# Altium project ECG circuit_PCB.PrjPcb
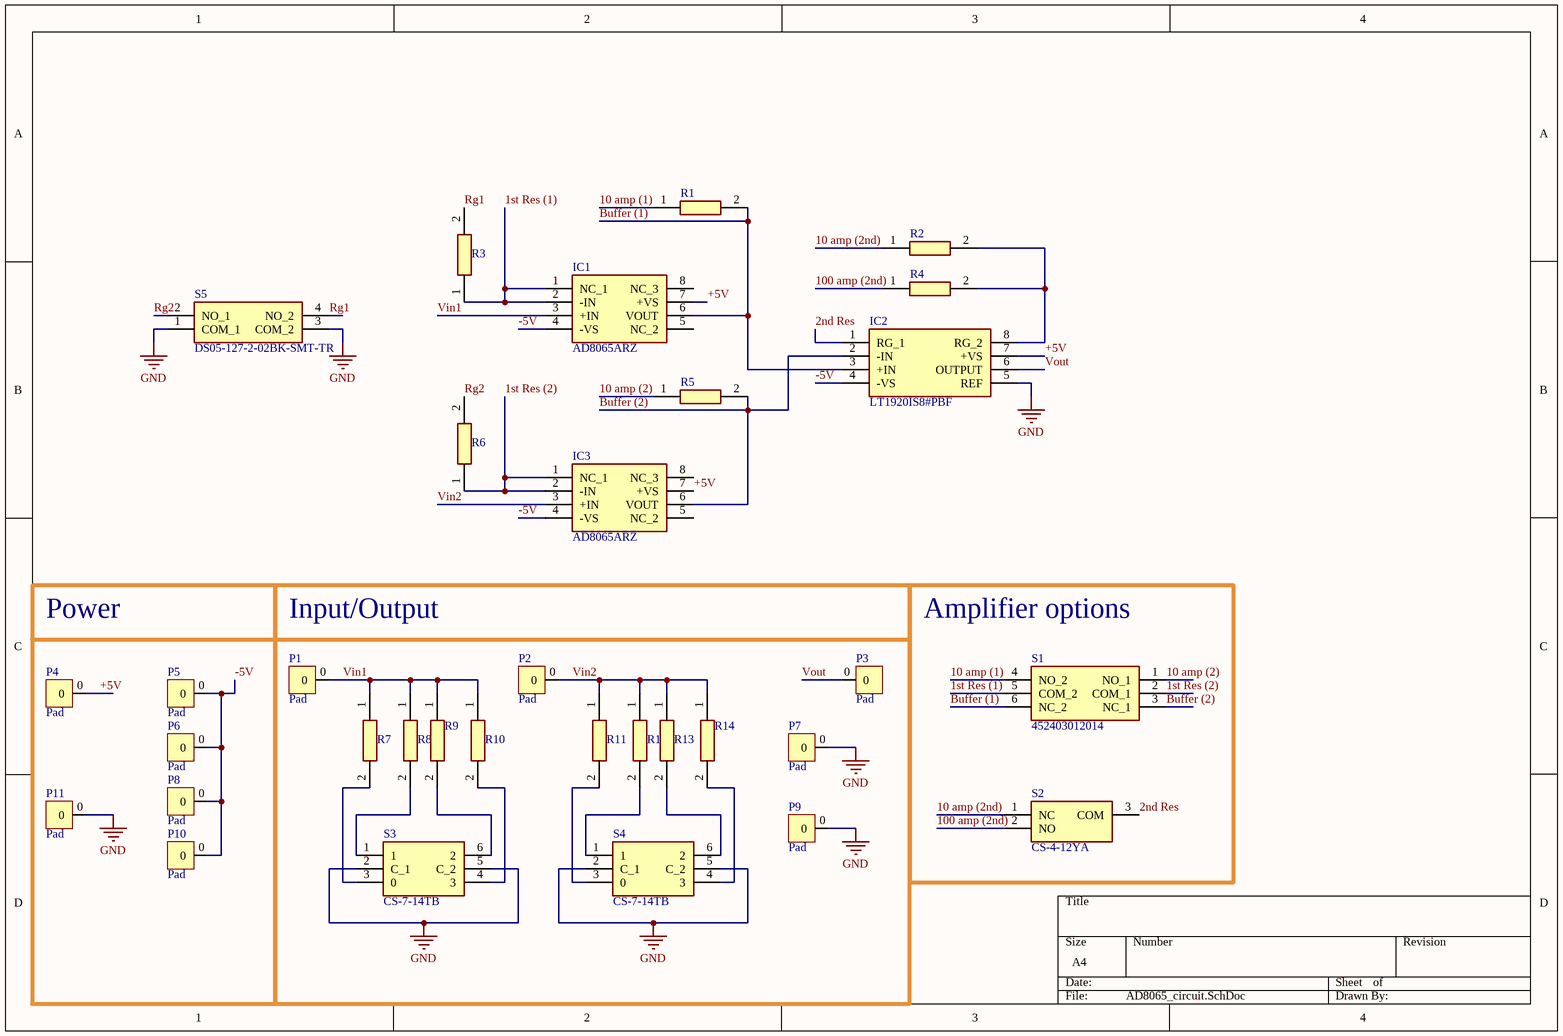
[diagram p0: AD8065_circuit.SchDoc]
1 sheet, 33 parts. Net scope: global (net labels, ports and power ports of the same name join across sheets).
Board file: AD8065_PCB.PcbDoc

## Sheet AD8065_circuit.SchDoc
size A4

### Parts
IC1  AD8065ARZ  [SOIC127P600X175-8N]
IC2  LT1920IS8#PBF  [SOIC127P599X175-8N]
IC3  AD8065ARZ  [SOIC127P600X175-8N]
P1  Pad  [Pad]
P2  Pad  [Pad]
P3  Pad  [Pad]
P4  Pad  [Pad]
P5  Pad  [Pad]
P6  Pad  [Pad]
P7  Pad  [Pad]
P8  Pad  [Pad]
P9  Pad  [Pad]
P10  Pad  [Pad]
P11  Pad  [Pad]
R1  CRG0805F270R  [RESC2012X65N]  (value not drawn)
R2  CRG0805F4K7  [RESC2012X65N]  (value not drawn)
R3  CRGH0805F20R  [RESC2013X65N]  (value not drawn)
R4  CRG0805F330R  [RESC2012X65N]  (value not drawn)
R5  CRG0805F270R  [RESC2012X65N]  (value not drawn)
R6  CRGH0805F20R  [RESC2013X65N]  (value not drawn)
R7  RH73X2A10GNTN  [RESC2013X50N]  (value not drawn)
R8  RH73X2A50GNTN  [RESC2013X50N]  (value not drawn)
R9  RH73H2A100MKTN  [RESC2013X50N]  (value not drawn)
R10  RH73W2A1GNTN  [RESC2013X50N]  (value not drawn)
R11  RH73X2A50GNTN  [RESC2013X50N]  (value not drawn)
R12  RH73X2A10GNTN  [RESC2013X50N]  (value not drawn)
R13  RH73W2A1GNTN  [RESC2013X50N]  (value not drawn)
R14  RH73H2A100MKTN  [RESC2013X50N]  (value not drawn)
S1  452403012014  [452403012014]
S2  CS-4-12YA  [CS412YA]
S3  CS-7-14TB  [SOP254P1000X405-6N]
S4  CS-7-14TB  [SOP254P1000X405-6N]
S5  DS05-127-2-02BK-SMT-TR  [DS05127202BKSMTTR]

### Blocks framed on the sheet
Power: P4-P6 P8 P10 P11
Input/Output: P1-P3 P7 P9 R7-R14 S3 S4
Amplifier options: S1 S2

### Nets
GND: IC2.5(REF) P7.0 P9.0 P11.0 S3.2(C_1) S3.5(C_2) S4.2(C_1) S4.5(C_2) S5.1(COM_1) S5.3(COM_2)
1st Res (1): IC1.1(NC_1) IC1.2(-IN) R3.1 S1.5(COM_2)
1st Res (2): IC3.1(NC_1) IC3.2(-IN) R6.1 S1.2(COM_1)
2nd Res: IC2.1(RG_1) S2.3(COM)
10 amp (1): R1.1 S1.4(NO_2)
10 amp (2): R5.1 S1.1(NO_1)
10 amp (2nd): R2.1 S2.1(NC)
100 amp (2nd): R4.1 S2.2(NO)
+5V: IC1.7(+VS) IC2.7(+VS) IC3.7(+VS) P4.0
-5V: IC1.4(-VS) IC2.4(-VS) IC3.4(-VS) P5.0 P6.0 P8.0 P10.0
Buffer (1): IC1.6(VOUT) IC2.3(+IN) R1.2 S1.6(NC_2)
Buffer (2): IC2.2(-IN) IC3.6(VOUT) R5.2 S1.3(NC_1)
Rg1: R3.2 S5.4(NO_2)
Rg2: R6.2 S5.2(NO_1)
Vin1: IC1.3(+IN) P1.0 R7.1 R8.1 R9.1 R10.1
Vin2: IC3.3(+IN) P2.0 R11.1 R12.1 R13.1 R14.1
Vout: IC2.6(OUTPUT) P3.0
NetIC2_8: IC2.8(RG_2) R2.2 R4.2
NetR7_2: R7.2 S3.3(0)
NetR8_2: R8.2 S3.1
NetR9_2: R9.2 S3.6(2)
NetR10_2: R10.2 S3.4(3)
NetR11_2: R11.2 S4.3(0)
NetR12_2: R12.2 S4.1
NetR13_2: R13.2 S4.6(2)
NetR14_2: R14.2 S4.4(3)

Not connected (* = marked no-connect by the designer): IC1 5(NC_2) 8(NC_3); IC3 5(NC_2) 8(NC_3)

### Library data of the parts
IC1 IC3 = AD8065ARZ: Integrated Circuit; Manufacturer_Name: Analog Devices; Datasheet Link: https://datasheet.datasheetarchive.com/originals/distributors/Datasheets-1/DSA-2047.pdf; Height: 1.75mm; Manufacturer_Part_Number: AD8065ARZ; Mouser Part Number: 584-AD8065ARZ; Mouser Price/Stock: https://www.mouser.co.uk/ProductDetail/Analog-Devices/AD8065ARZ?qs=%2FtpEQrCGXCyXd34RglYLzQ%3D%3D; Arrow Part Number: AD8065ARZ; Arrow Price/Stock: https://www.arrow.com/en/products/ad8065arz/analog-devices?region=nac
IC2 = LT1920IS8#PBF: Integrated Circuit; Manufacturer_Name: Analog Devices; Datasheet Link: https://datasheet.datasheetarchive.com/originals/distributors/SFDatasheet-4/sf-00091026.pdf; Height: 1.752mm; Manufacturer_Part_Number: LT1920IS8#PBF; Mouser Part Number: 584-LT1920IS8#PBF; Mouser Price/Stock: https://www.mouser.co.uk/ProductDetail/Analog-Devices/LT1920IS8PBF?qs=ytflclh7QUWOSod6PqfjSg%3D%3D; Arrow Part Number: LT1920IS8#PBF; Arrow Price/Stock: https://www.arrow.com/en/products/lt1920is8pbf/analog-devices?region=nac
R1 R5 = CRG0805F270R: Resistor 270; Manufacturer_Name: TE Connectivity; Datasheet Link: http://www.te.com/commerce/DocumentDelivery/DDEController?Action=showdoc&DocId=Customer+Drawing%7F1623109%7FBA%7Fpdf%7FEnglish%7FENG_CD_1623109_BA.pdf%7F1623109-1; Height: 0.65mm; Manufacturer_Part_Number: CRG0805F270R; Mouser Part Number: 279-CRG0805F270R; Mouser Price/Stock: https://www.mouser.com/Search/Refine.aspx?Keyword=279-CRG0805F270R; Arrow Part Number: CRG0805F270R; Arrow Price/Stock: https://www.arrow.com/en/products/crg0805f270r/te-connectivity
R2 = CRG0805F4K7: Resistor 4.7k; Manufacturer_Name: TE Connectivity; Datasheet Link: http://www.te.com/commerce/DocumentDelivery/DDEController?Action=showdoc&DocId=Customer+Drawing%7F1623109%7FBA%7Fpdf%7FEnglish%7FENG_CD_1623109_BA.pdf%7F1623109-1; Height: 0.65mm; Manufacturer_Part_Number: CRG0805F4K7; Mouser Part Number: 279-CRG0805F4K7; Mouser Price/Stock: https://www.mouser.co.uk/ProductDetail/TE-Connectivity-Holsworthy/CRG0805F4K7?qs=VHcS2MTj4gYTCl8bEMP1DQ%3D%3D; Arrow Part Number: CRG0805F4K7; Arrow Price/Stock: https://www.arrow.com/en/products/crg0805f4k7/te-connectivity?region=nac
R3 R6 = CRGH0805F20R: Resistor 20; Manufacturer_Name: TE Connectivity; Datasheet Link: http://docs-europe.electrocomponents.com/webdocs/12d7/0900766b812d7379.pdf; Height: 0.65mm; Manufacturer_Part_Number: CRGH0805F20R; Mouser Part Number: 279-CRGH0805F20R; Mouser Price/Stock: https://www.mouser.co.uk/ProductDetail/TE-Connectivity-Holsworthy/CRGH0805F20R?qs=9ylKvqdyudmw671oFSmSiA%3D%3D
R4 = CRG0805F330R: Resistor 330; Manufacturer_Name: TE Connectivity; Datasheet Link: http://www.te.com/commerce/DocumentDelivery/DDEController?Action=showdoc&DocId=Customer+Drawing%7F1623109%7FBA%7Fpdf%7FEnglish%7FENG_CD_1623109_BA.pdf%7F1623109-1; Height: 0.65mm; Manufacturer_Part_Number: CRG0805F330R; Mouser Part Number: 279-CRG0805F330R; Mouser Price/Stock: https://www.mouser.co.uk/ProductDetail/TE-Connectivity-Holsworthy/CRG0805F330R?qs=VHcS2MTj4gbLzLJ0%2FI3gmA%3D%3D; Arrow Part Number: CRG0805F330R; Arrow Price/Stock: https://www.arrow.com/en/products/crg0805f330r/te-connectivity?region=nac
R7 R12 = RH73X2A10GNTN: Resistor 10G; Manufacturer_Name: TE Connectivity; Datasheet Link: https://ms.componentsearchengine.com/Datasheets/2/RH73X2A10GNTN.pdf; Height: 0.5mm; Manufacturer_Part_Number: RH73X2A10GNTN; Mouser Part Number: 279-RH73X2A10GNTN; Mouser Price/Stock: https://www.mouser.co.uk/ProductDetail/TE-Connectivity-Holsworthy/RH73X2A10GNTN?qs=ip69W3eHERU7YDrLGqSvdQ%3D%3D; Arrow Part Number: RH73X2A10GNTN; Arrow Price/Stock: https://www.arrow.com/en/products/rh73x2a10gntn/te-connectivity?region=nac
R8 R11 = RH73X2A50GNTN: Resistor 50G; Manufacturer_Name: TE Connectivity; Datasheet Link: http://www.te.com/commerce/DocumentDelivery/DDEController?Action=showdoc&DocId=Data+Sheet%7F1773268%7FA%7Fpdf%7FEnglish%7FENG_DS_1773268_A.pdf%7F1625862-4; Height: 0.5mm; Manufacturer_Part_Number: RH73X2A50GNTN; Mouser Part Number: 279-RH73X2A50GNTN; Mouser Price/Stock: https://www.mouser.co.uk/ProductDetail/TE-Connectivity-Holsworthy/RH73X2A50GNTN?qs=ip69W3eHERVWqEnkYPnkdA%3D%3D
R9 R14 = RH73H2A100MKTN: Resistor 100M; Manufacturer_Name: TE Connectivity; Datasheet Link: http://www.te.com/commerce/DocumentDelivery/DDEController?Action=showdoc&DocId=Data+Sheet%7F1773268%7FA%7Fpdf%7FEnglish%7FENG_DS_1773268_A.pdf%7F1625856-2; Height: 0.5mm; Manufacturer_Part_Number: RH73H2A100MKTN; Mouser Part Number: 279-RH73H2A100MKTN; Mouser Price/Stock: https://www.mouser.co.uk/ProductDetail/TE-Connectivity-Holsworthy/RH73H2A100MKTN?qs=ip69W3eHERW4mrE8f49Fxw%3D%3D; Arrow Part Number: RH73H2A100MKTN; Arrow Price/Stock: https://www.arrow.com/en/products/rh73h2a100mktn/te-connectivity?region=nac
R10 R13 = RH73W2A1GNTN: Resistor 1G; Manufacturer_Name: TE Connectivity; Datasheet Link: https://componentsearchengine.com/Datasheets/2/RH73W2A1GNTN.pdf; Height: 0.5mm; Manufacturer_Part_Number: RH73W2A1GNTN; Mouser Part Number: 279-RH73W2A1GNTN; Mouser Price/Stock: https://www.mouser.co.uk/ProductDetail/TE-Connectivity-Holsworthy/RH73W2A1GNTN?qs=ip69W3eHERV4S8tLXHYflA%3D%3D; Arrow Part Number: RH73W2A1GNTN; Arrow Price/Stock: https://www.arrow.com/en/products/rh73w2a1gntn/te-connectivity?region=nac
S1 = 452403012014: Switch; Manufacturer_Name: Wurth Elektronik; Datasheet Link: https://katalog.we-online.de/em/datasheet/452403012014.pdf; Height: 3.3mm; Manufacturer_Part_Number: 452403012014; Mouser Part Number: 710-452403012014; Mouser Price/Stock: https://www.mouser.co.uk/ProductDetail/Wurth-Elektronik/452403012014?qs=DvsTirrhYfOi0QxHyAEO3w%3D%3D
S2 = CS-4-12YA: Switch; Manufacturer_Name: NIDEC COPAL; Datasheet Link: https://www.nidec-copal-electronics.com/j/product/detail/00000197/; Height: 2.6mm; Manufacturer_Part_Number: CS-4-12YA
S3 S4 = CS-7-14TB: Switch; Manufacturer_Name: Copal Electronics; Datasheet Link: https://www.nidec-copal-electronics.com/e/catalog/switch/cs-7.pdf; Height: 4.05mm; Manufacturer_Part_Number: CS-7-14TB
S5 = DS05-127-2-02BK-SMT-TR: Switch; Manufacturer_Name: CUI Devices; Datasheet Link: https://www.cuidevices.com/product/resource/digikeypdf/ds05-127-smt.pdf; Height: 2.6mm; Manufacturer_Part_Number: DS05-127-2-02BK-SMT-TR; Mouser Part Number: 490-DS05127202BK-STR; Mouser Price/Stock: https://www.mouser.co.uk/ProductDetail/CUI-Devices/DS05-127-2-02BK-SMT-TR?qs=wnTfsH77Xs6TIyf6yhikhg%3D%3D